# EAGLE design Grove - 6-Axis Accelerometer&Compass v1.0 (EAGLE 6.4)
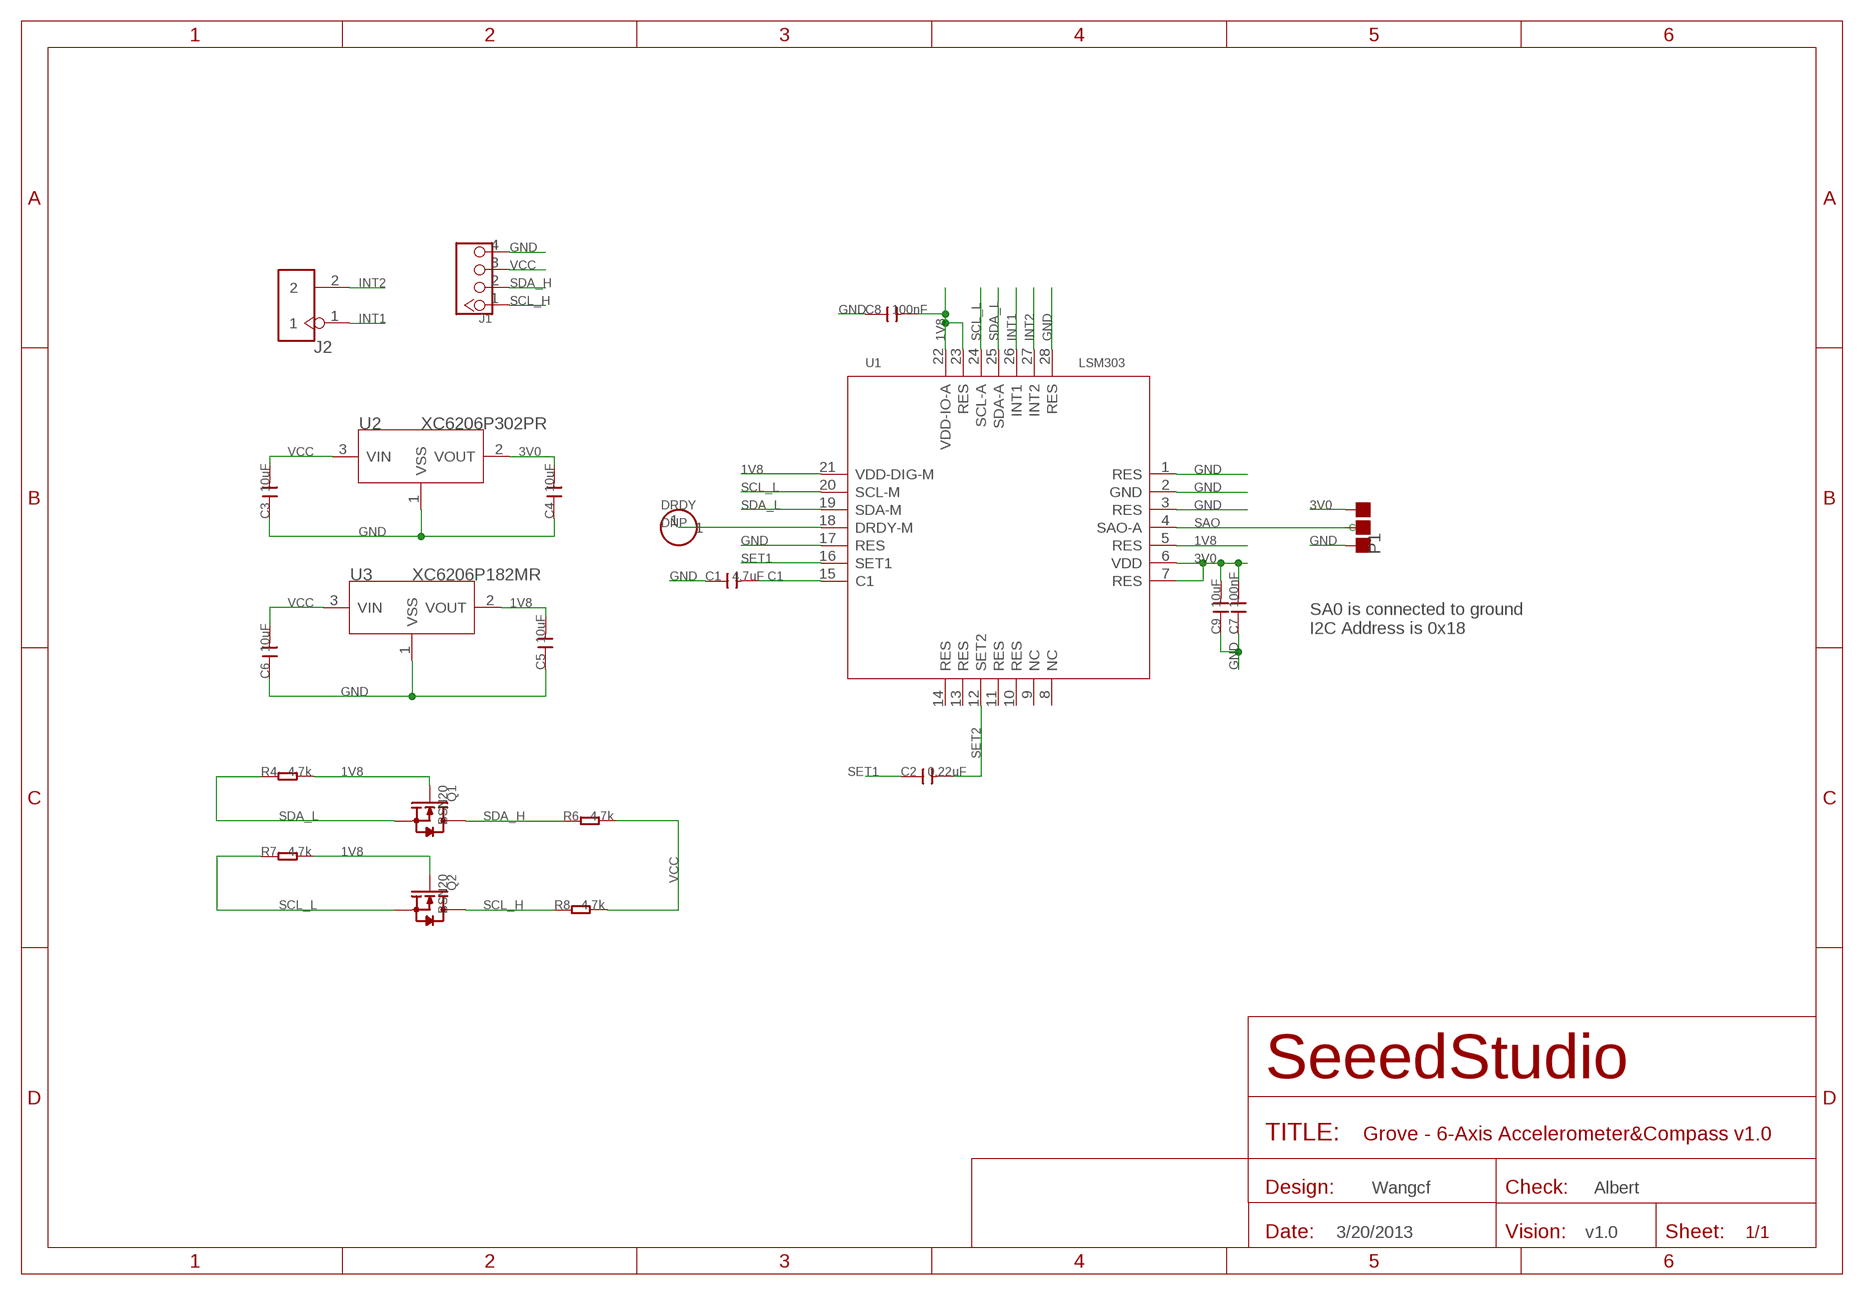
[diagram p0: schematic, sheet 1]

## Parts
C1  4.7uF  C-0805  [C0805]
C2  0.22uF  C-0603  [C0603]
C3  10uF  C-0805  [C0805]
C4  10uF  C-0805  [C0805]
C5  10uF  C-0805  [C0805]
C6  10uF  C-0805  [C0805]
C7  100nF  C-0603  [C0603]
C8  100nF  C-0603  [C0603]
C9  10uF  C-0805  [C0805]
DRDY  DNP  HEADER-1P-35  [1P-65/35MIL]
J1  TWIG-4P-2.0-2.0  [4P-2.0]
J2  HEADER-2P-65/35MIL  [2P-2.54-65/35MIL]
P1  PAD-JUMPER-3P-40*40  [3P-SMD-4.1X1.5]
Q1  BSN20  MOSFET-N'SOT23'  [SOT23]
Q2  BSN20  MOSFET-N'SOT23'  [SOT23]
R4  4.7k  R-0603  [R0603]
R6  4.7k  R-0603  [R0603]
R7  4.7k  R-0603  [R0603]
R8  4.7k  R-0603  [R0603]
U1  LSM303  LSM303DLH  [LGA-28]
U2  XC6206P302PR  XC6206MR  [SOT23]
U3  XC6206P182MR  XC6206MR  [SOT23]

## Nets
1V8: C5.2 C8.2 Q1.1(G) Q2.1(G) R4.2 R7.2 U1.5(RES) U1.21(VDD-DIG-M) U1.22(VDD-IO-A) U1.23(RES) U3.2(VOUT)
3V0: C4.2 C7.2 C9.2 P1.00(L) U1.6(VDD) U1.7(RES) U2.2(VOUT)
C1: C1.2 U1.15(C1)
DRDY: DRDY.1 U1.18(DRDY-M)
GND: C1.1 C3.1 C4.1 C5.1 C6.1 C7.1 C8.1 C9.1 J1.4 P1.11(R) U1.1(RES) U1.2(GND) U1.3(RES) U1.17(RES) U1.28(RES) U2.1(VSS) U3.1(VSS)
INT1: J2.1 U1.26(INT1)
INT2: J2.2 U1.27(INT2)
SAO: P1.MM(C) U1.4(SAO-A)
SCL_H: J1.1 Q2.3(D) R8.1
SCL_L: Q2.2(S) R7.1 U1.20(SCL-M) U1.24(SCL-A)
SDA_H: J1.2 Q1.3(D) R6.1
SDA_L: Q1.2(S) R4.1 U1.19(SDA-M) U1.25(SDA-A)
SET1: C2.1 U1.16(SET1)
SET2: C2.2 U1.12(SET2)
VCC: C3.2 C6.2 J1.3 R6.2 R8.2 U2.3(VIN) U3.3(VIN)
Unconnected: U1.8(NC) U1.9(NC) U1.10(RES) U1.11(RES) U1.13(RES) U1.14(RES)

## Notes on the sheet
- SA0 is connected to ground
  I2C Address is 0x18
- Wangcf | Albert
- 3/20/2013 | v1.0

## Library data of the parts
C1-C9 = Discrete:C*: Ceramic Capacitors
DRDY = Connector:HEADER-1P
J1 = Connector:TWIG-4P-2.0
J2 = Connector:HEADER-2P
P1 = Discrete:PAD-JUMPER-3P; PARTNO: DNP
Q1 Q2 = Discrete:MOSFET-N: IRLL014: http://www.vishay.com/docs/91319/sihll014.pdf
R4 R6-R8 = Discrete:R*
U1 = template:LSM303: 3-axis accelerometer and 3-axis magnetometer
U2 U3 = IC:XC6206: LOW ESR Cap.Compatible Positive Voltage Regulators

## Net classes
0 default: width 0.203 mm, drill 0.305 mm, clearance 0.203 mm

## Board
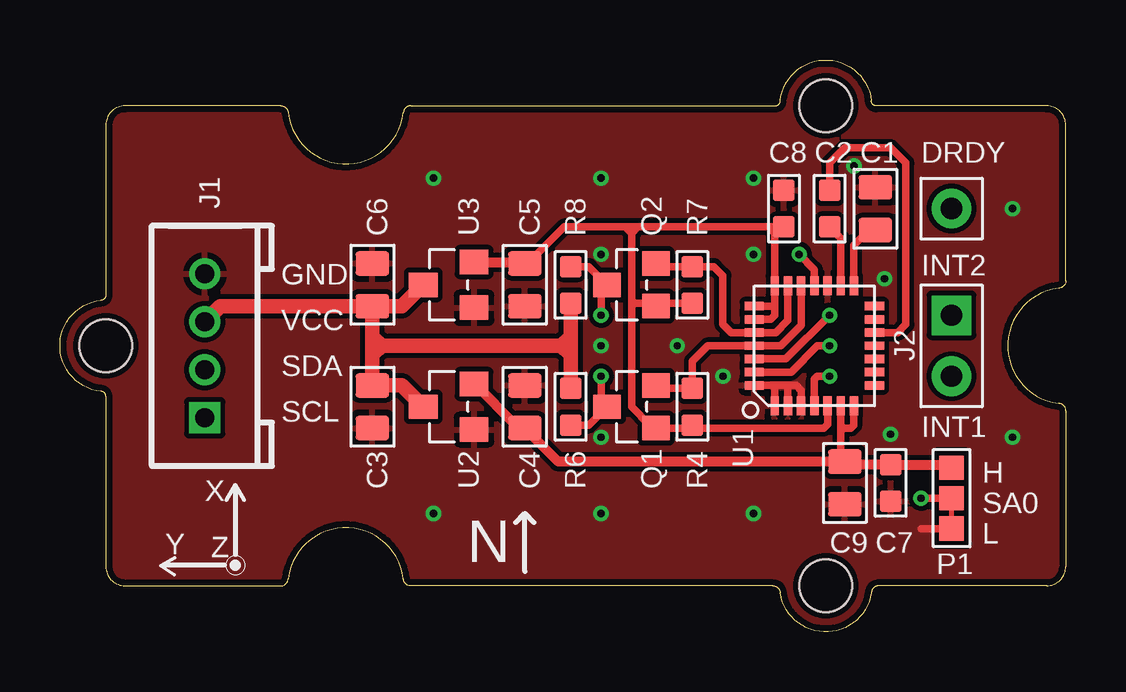
[diagram p1: board, top side]
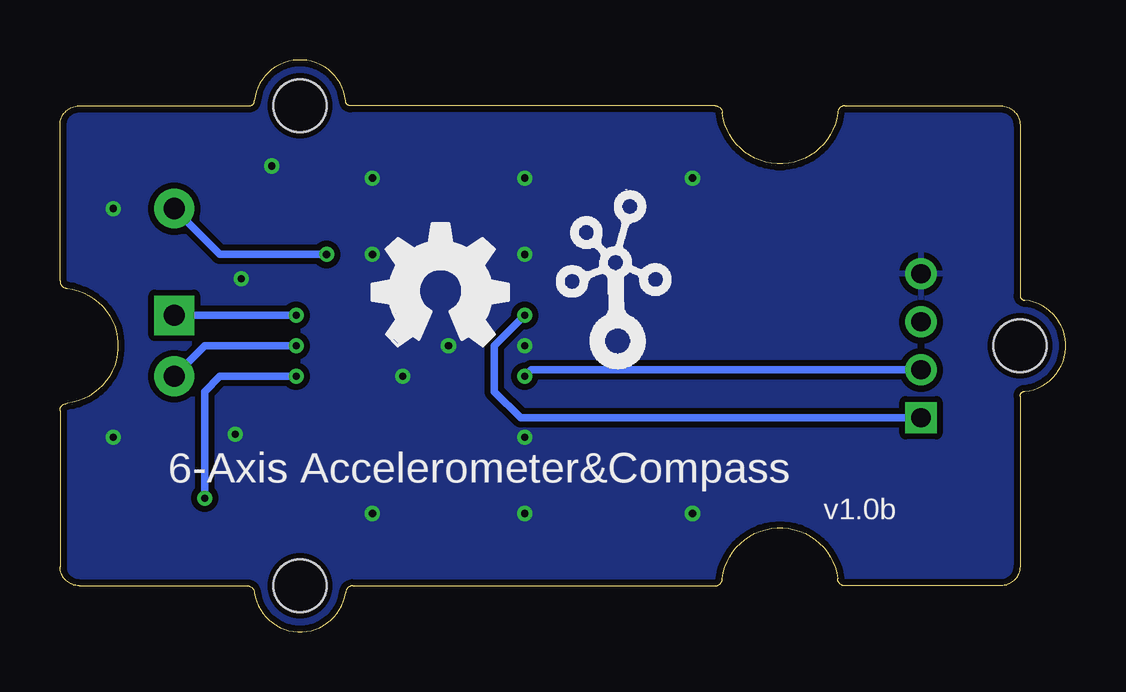
[diagram p2: board, bottom side, seen from below]

Size 41.91 x 23.83 mm. Coordinates in mm from the lower left corner, seen from the top.
Copper layers (1*16): Top 0.035mm / dielectric 1.5mm / Bottom 0.035mm
Design rules "SeeedStudio_rule_no_angle_090911 *": minimum track width 6mil, minimum drill 12mil, track to track 6mil, track to pad 6mil, pad to pad 6mil, via to via 6mil, smd to smd 0mil, copper to edge 10mil, drill to drill 10mil, minimum pad ring 10mil, minimum via ring 6mil, stop-mask expansion 2mil, vias tented up to drill 25mil, thermal gap 10mil
tRestrict: area 30,9.1 to 30.1,9.8; area 30.6,9.1 to 30.7,9.8

### Footprints (pad centres in the part's own frame; a part is rotated, then mirrored left to right if it is on the bottom)
C0805 = smd 1.016 x 1.397: 1 -0.889,0; 2 0.889,0
C0603 = smd 0.889 x 0.889: 1 -0.762,0; 2 0.762,0
1P-65/35MIL = drill 0.889 pad 1.651: 1 0,0
4P-2.0 = drill 0.8 pad 1.27 square: 1 -3,0 | drill 0.8 pad 1.27: 2 -1,0; 3 1,0; 4 3,0
2P-2.54-65/35MIL = drill 0.889 pad 1.651 square: 1 0,1.27 | drill 0.889 pad 1.651: 2 0,-1.27
3P-SMD-4.1X1.5 = smd 1.016 x 1.016: 00 -1.27,0; 11 1.27,0; MM 0,0
SOT23 = smd 1.016 x 1.143: 1 -0.889,-1.016; 2 0.889,-1.016; 3 0,1.016
R0603 = smd 0.889 x 0.889: 1 -0.762,0; 2 0.762,0
LGA-28 = smd 0.8 x 0.35: 1 -2.503,1.65; 2 -2.503,1.1; 3 -2.503,0.55; 4 -2.503,0; 5 -2.503,-0.55; 6 -2.503,-1.1; 7 -2.503,-1.65; 15 2.503,-1.65; 16 2.503,-1.1; 17 2.503,-0.55; 18 2.503,0; 19 2.503,0.55; 20 2.503,1.1; 21 2.503,1.65 | smd 0.35 x 0.8: 8 -1.65,-2.503; 9 -1.1,-2.503; 10 -0.55,-2.503; 11 0,-2.503; 12 0.55,-2.503; 13 1.1,-2.503; 14 1.65,-2.503; 22 1.65,2.503; 23 1.1,2.503; 24 0.55,2.503; 25 0,2.503; 26 -0.55,2.503; 27 -1.1,2.503; 28 -1.65,2.503
SOT23' = smd 1.016 x 1.2: 1 -0.95,-1.06; 2 0.95,-1.06; 3 0,1.06
2U-DIM-W/DRILL = hole 2.2: -10,-10; -10,10; 20,0

### Placement (x,y rotation side)
C1  33.97,17.64 270 top
C2  32.07,17.64 90 top
C3  13.02,9.38 90 top
C4  19.37,9.38 270 top
C5  19.37,14.46 90 top
C6  13.02,14.46 270 top
C7  34.61,6.21 90 top
C8  30.16,17.64 270 top
C9  32.7,6.21 90 top
DRDY  37.15,17.64 0 top
J1  6.03,11.92 90 top
J2  37.15,11.92 0 top
P1  37.15,5.57 270 top
Q1  23.81,9.38 90 top
Q2  23.81,14.46 90 top
R4  26.35,9.38 270 top
R6  21.27,9.38 90 top
R7  26.35,14.46 270 top
R8  21.27,14.46 270 top
U1  31.43,11.92 90 top
U2  XC6206P302PR  [SOT23']  16.19,9.38 90 top
U3  XC6206P182MR  [SOT23']  16.19,14.46 90 top
U$2  [2U-DIM-W/DRILL]  21.91,11.92 180 top
U$3  [TWIGLOGO]  18.73,11.92 0 bottom
U$4  [OSHW_FILLX200_NOTEXT]  28.89,11.92 0 bottom

### Tracks (layer width: path | path; a pad name or v marks a point on that pad's centre or on a via)
1V8
  Top 0.305: 29.78,13.57 U1.21 29.78,16.62 | 29.78,13.57 29.78,13.19 29.61,13.02 U1.23 | U1.22 29.65,13.57 29.66,13.57 29.78,13.57 | 29.78,16.62 29.78,16.75 29.91,16.87 29.53,16.87 | 29.53,16.87 24.07,16.87 | 24.07,16.87 23.81,16.87 | 23.81,16.87 23.56,16.87 | 23.56,16.87 21.02,16.87 19.5,15.35 C5.2 | 23.81,13.57 23.81,9.38 24.58,8.62 24.96,8.62 Q1.1 26.48,8.49 | 23.81,13.57 23.81,13.7 | 23.81,13.7 23.81,13.83 | 23.81,13.83 23.81,16.62 | 23.81,16.62 23.81,16.87 | R7.2 24.7,13.7 | 23.81,13.7 23.94,13.7 | 23.94,13.7 24.7,13.7 | 24.7,13.7 Q2.1 | U1.5 31.98,8.66 31.81,8.49 26.48,8.49 | 26.48,8.49 R4.2 | 23.81,16.62 23.56,16.87 | 23.81,16.62 24.07,16.87 | 23.81,13.83 23.94,13.7 | 23.94,13.7 23.81,13.57 | 29.78,16.62 29.53,16.87
  Top 0.406: U3.2 19.31,15.41 C5.2 | Q1.1 24.7,8.49 | C8.2 29.91,16.87
3V0
  Top 0.254: 32.58,8.37 32.7,8.49
  Top 0.305: U1.6 32.53,8.62 | 32.53,8.62 32.53,7.27 C9.2 | U1.7 33.08,8.62 32.96,8.49 32.7,8.49 32.66,8.49 32.53,8.62
  Top 0.406: P1.00 37.02,6.97 C7.2 32.83,6.97 C9.2 20.77,7.1 C4.2 19.24,8.62 18.99,8.62 17.28,10.33 U2.2
C1
  Top 0.305: U1.15 33.08,16.11 33.72,16.75 C1.2
DRDY  (via drill 0.3 pad 0.64)
  Top 0.305: U1.18 31.43,15.1 v30.8,15.73
  Bottom 0.305: v30.8,15.73 35.24,15.73 DRDY.1
GND  (via drill 0.3 pad 0.64)
  Top 0.203: P1.11 37.15,5.57
  Top 0.305: U1.28 29.78,10.27 | 29.78,10.27 30.29,10.27 | 30.29,10.27 30.67,10.27 30.88,10.06 U1.3 | U1.1 29.78,10.27 | U1.2 30.33,10.23 30.29,10.27 | P1.11 35.88,4.3
  other vias: 27.62,10.65 34.35,14.72 33.08,19.41 34.61,8.24 28.89,15.73 25.72,11.92 22.54,11.92 22.54,8.11 22.54,15.73 39.69,17.64 39.69,8.11 28.89,4.94 22.54,4.94 15.56,4.94 15.56,18.91 22.54,18.91 28.89,18.91
  pour Top (isolate 0.203): -0.32,23.99 42.86,23.99 42.86,-0.14 -0.32,-0.14 -0.32,21.57
  pour Bottom (isolate 0.254): -0.32,23.99 42.86,23.99 42.86,-0.14 -0.32,-0.14
INT1  (via drill 0.3 pad 0.64)
  Top 0.305: U1.26 30.25,11.37 v32.07,13.19
  Bottom 0.305: v32.07,13.19 J2.1
INT2  (via drill 0.3 pad 0.64)
  Top 0.305: U1.27 30.46,10.82 31.56,11.92 v32.07,11.92
  Bottom 0.305: v32.07,11.92 35.88,11.92 J2.2
SAO  (via drill 0.3 pad 0.64)
  Top 0.305: P1.MM v35.88,5.57 | U1.4 31.43,10.52 31.56,10.65 v32.07,10.65
  Bottom 0.305: v32.07,10.65 35.24,10.65 35.88,10.02 v35.88,5.57
SCL_H  (via drill 0.3 pad 0.64)
  Top 0.305: R8.1 22.04,15.22 Q2.3 | v22.54,13.19 22.54,14.21
  Top 0.406: 22.54,14.21 Q2.3
  Bottom 0.305: J1.1 22.72,8.92 23.81,10.02 23.81,11.92 v22.54,13.19
SCL_L
  Top 0.305: Q2.2 24.96,15.22 R7.1 27.24,15.22 27.62,14.84 27.62,12.81 27.96,12.47 U1.24 29.82,12.47 30.33,12.98 U1.20
SDA_H  (via drill 0.3 pad 0.64)
  Top 0.305: R6.1 22.04,8.62 Q1.3 | v22.54,10.65 22.54,9.64
  Top 0.406: 22.54,9.64 Q1.3
  Bottom 0.305: J1.2 22.27,10.92 v22.54,10.65
SDA_L
  Top 0.305: U1.19 30.88,12.77 30.04,11.92 U1.25 26.99,11.92 26.35,11.29 R4.1 24.7,10.14 Q1.2
SET1
  Top 0.305: U1.16 32.53,16.41 C2.1
SET2
  Top 0.305: U1.12 34.9,12.47 35.24,12.81 35.24,19.54 34.61,20.18 32.7,20.18 32.07,19.54 C2.2
VCC
  Top 0.61: C6.2 6.68,13.57 J1.3 | 13.02,11.54 C3.2 14.24,10.27 U2.3 | 13.02,11.54 13.02,12.05 | 13.02,12.05 13.02,12.3 | 13.02,12.3 C6.2 | C6.2 14.24,13.57 U3.3 | R8.2 21.27,12.3 | 21.27,12.3 21.27,11.92 | 21.27,11.92 21.27,11.54 | 21.27,11.54 R6.2 | 21.27,11.92 20.89,11.92 | 20.89,11.92 13.4,11.92 | 13.4,11.92 13.15,11.92 13.02,12.05 | 13.4,11.92 13.02,12.3 | 13.4,11.92 13.02,11.54 | 21.27,11.54 20.89,11.92 | 20.89,11.92 21.27,12.3

### Text on the board
tPlace: GND | INT2 | VCC | SDA | SCL | INT1 | H | SA0 | L | N
bPlace: 6-Axis Accelerometer&Compass | v1.0b
tNames: X | Y | Z